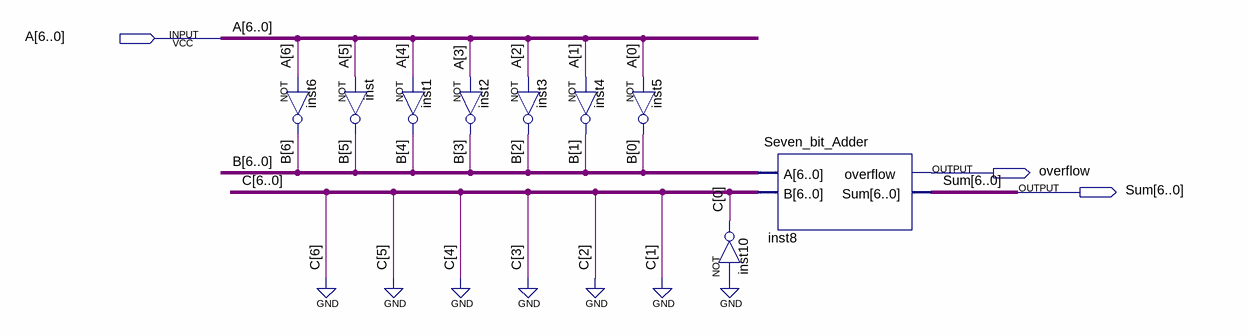
[diagram p0: schematic sheet]
// Quartus schematic Twos_Complement.bdf as structural Verilog: 9 symbols, 3 pins
module Twos_Complement (
  input  [6:0] A,
  output overflow,
  output [6:0] Sum
);

  wire [0:0] C;
  wire [6:0] B;

  not inst6 (B[6], A[6]);
  not inst (B[5], A[5]);
  not inst1 (B[4], A[4]);
  not inst2 (B[3], A[3]);
  not inst3 (B[2], A[2]);
  not inst4 (B[1], A[1]);
  not inst5 (B[0], A[0]);
  not inst10 (C[0], 1'b0);
  Seven_bit_Adder inst8 (.A(B), .B({{6{1'b0}}, C[0]}), .overflow(overflow), .Sum(Sum));
endmodule
